# Altium project HighPowerBiPolarStepperProject.PrjPCB
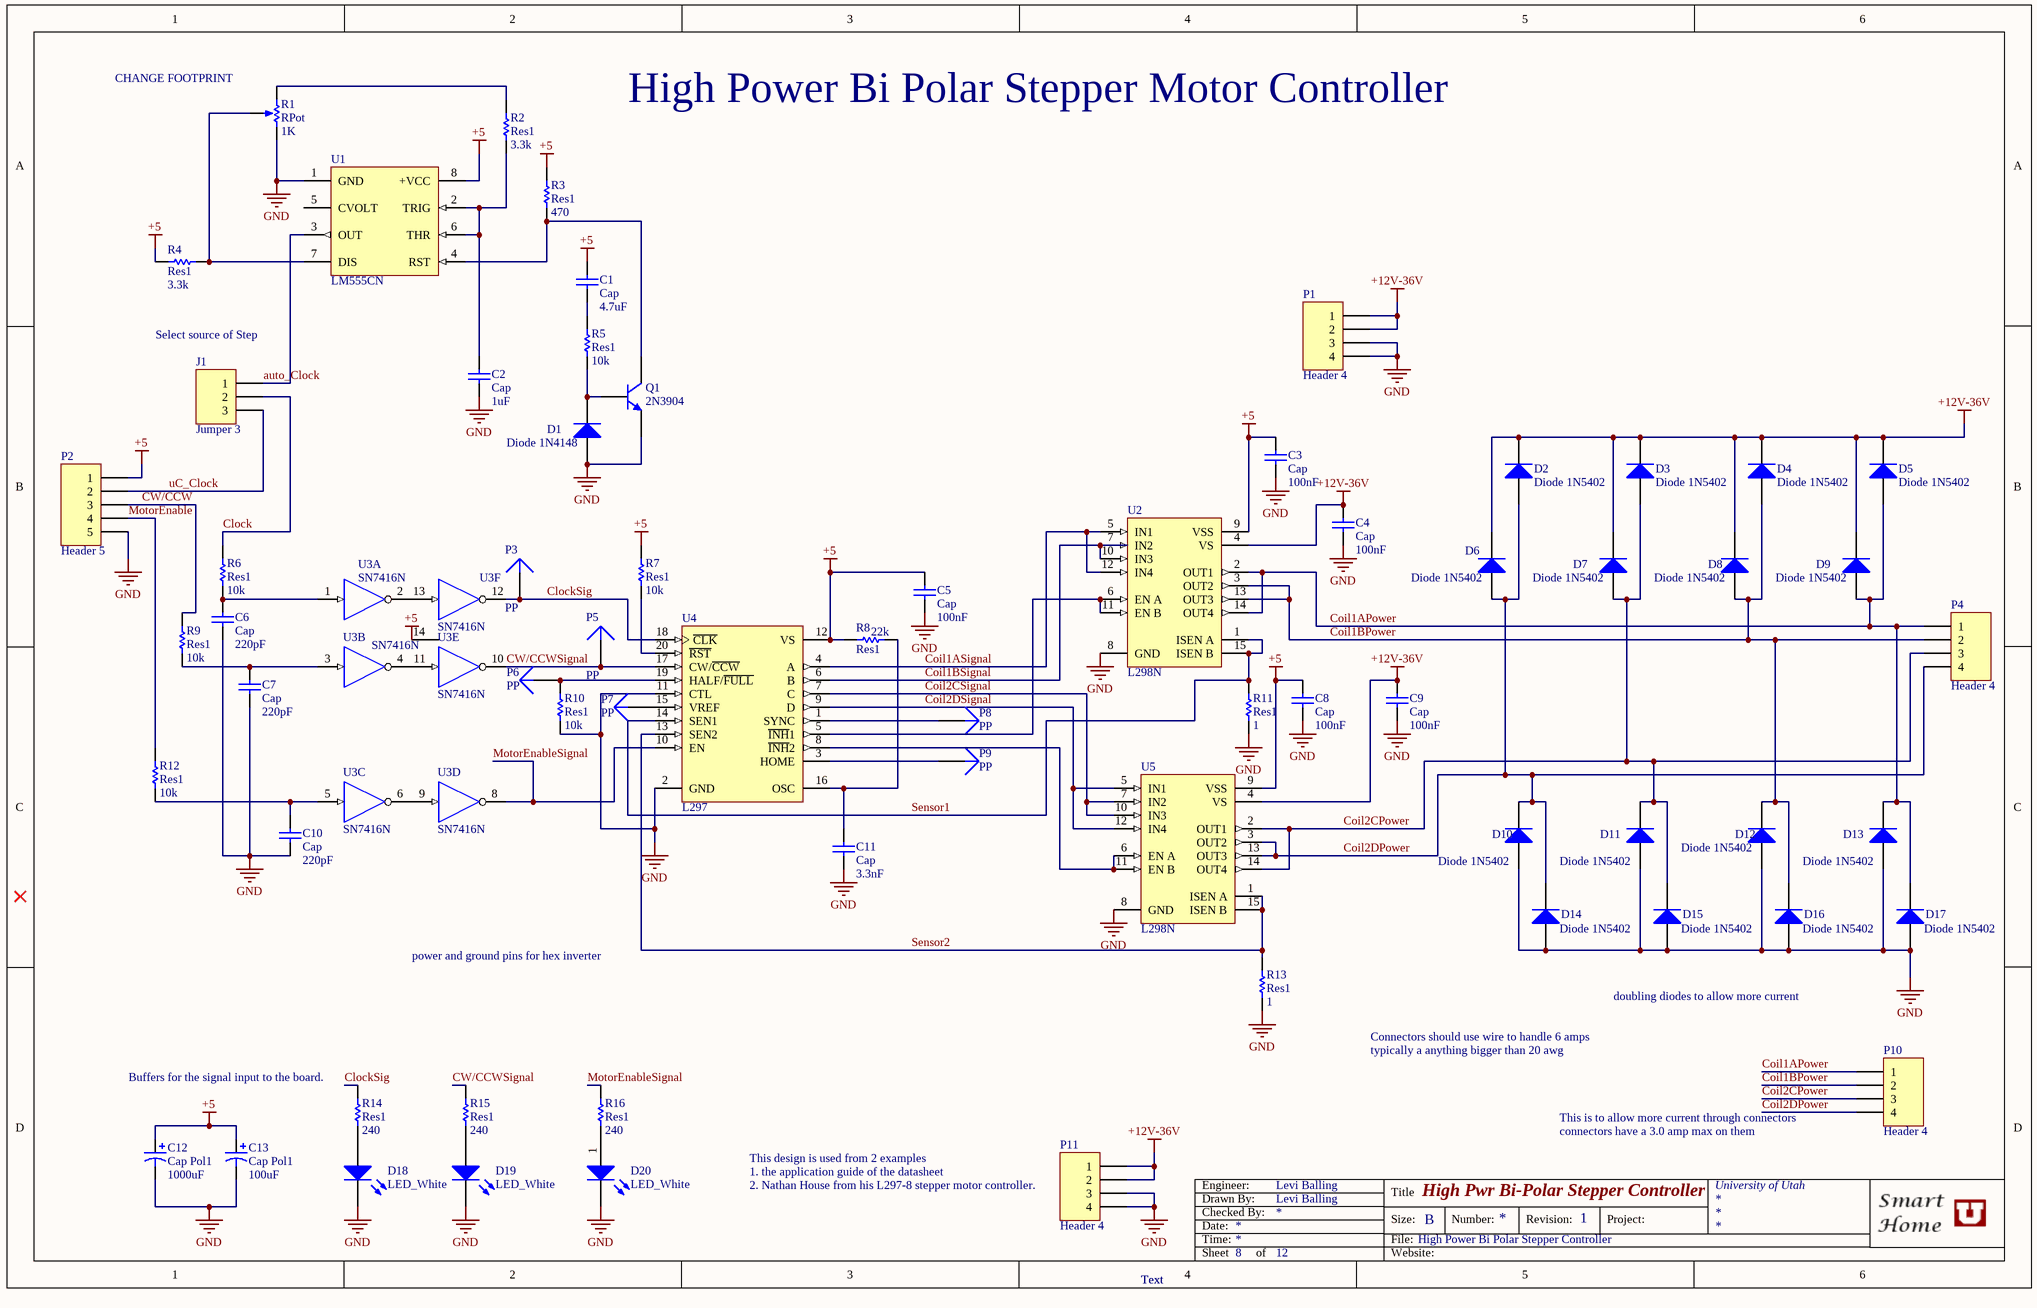
[diagram p0: HighPowerBiPolarStepperMotorSchem.SchDoc]
1 sheet, 67 parts. Net scope: global (net labels, ports and power ports of the same name join across sheets).
Board file: HighPowerBiPolarStepperMotorDriver.PcbDoc

## Sheet HighPowerBiPolarStepperMotorSchem.SchDoc: High Pwr Bi-Polar Stepper Controller
size B; Author: Levi Balling; DrawnBy: Levi Balling; Engineer: Levi Balling; Organization: University of Utah; Revision: 1; SheetNumber: 8; SheetTotal: 12; DocumentName: High Power Bi Polar Stepper Controller; ProjectName: Smart Home

### Parts
C1  Cap  value 4.7uF  [RAD-0.2]
C2  Cap  value 1uF  [RAD-0.2]
C3  Cap  value 100nF  [RAD-0.2]
C4  Cap  value 100nF  [RAD-0.2]
C5  Cap  value 100nF  [RAD-0.2]
C6  Cap  value 220pF  [RAD-0.2]
C7  Cap  value 220pF  [RAD-0.2]
C8  Cap  value 100nF  [RAD-0.2]
C9  Cap  value 100nF  [RAD-0.2]
C10  Cap  value 220pF  [RAD-0.2]
C11  Cap  value 3.3nF  [RAD-0.2]
C12  Cap Pol1  value 1000uF  [RB7.6-15]
C13  Cap Pol1  value 100uF  [RB7.6-15]
D1  Diode 1N4148  [DO-35]
D2  Diode 1N5402  [DO-201AD]
D3  Diode 1N5402  [DO-201AD]
D4  Diode 1N5402  [DO-201AD]
D5  Diode 1N5402  [DO-201AD]
D6  Diode 1N5402  [DO-201AD]
D7  Diode 1N5402  [DO-201AD]
D8  Diode 1N5402  [DO-201AD]
D9  Diode 1N5402  [DO-201AD]
D10  Diode 1N5402  [DO-201AD]
D11  Diode 1N5402  [DO-201AD]
D12  Diode 1N5402  [DO-201AD]
D13  Diode 1N5402  [DO-201AD]
D14  Diode 1N5402  [DO-201AD]
D15  Diode 1N5402  [DO-201AD]
D16  Diode 1N5402  [DO-201AD]
D17  Diode 1N5402  [DO-201AD]
D18  LED_White  [LED]
D19  LED_White  [LED]
D20  LED_White  [LED]
J1  Jumper 3  [HDR1X3]
P1  Header 4  [HDR1X4]
P2  Header 5  [HDR1X5]
P3  PP  [PIN1]
P4  Header 4  [HDR1X4]
P5  PP  [PIN1]
P6  PP  [PIN1]
P7  PP  [PIN1]
P8  PP  [PIN1]
P9  PP  [PIN1]
P10  Header 4  [HDR1X4]
P11  Header 4  [HDR1X4]
Q1  2N3904  [2N3904]
R1  RPot  value 1K  [Variable_Resistor]
R2  Res1  value 3.3k  [AXIAL-0.3]
R3  Res1  value 470  [AXIAL-0.3]
R4  Res1  value 3.3k  [AXIAL-0.3]
R5  Res1  value 10k  [AXIAL-0.3]
R6  Res1  value 10k  [AXIAL-0.3]
R7  Res1  value 10k  [AXIAL-0.3]
R8  Res1  value 22k  [AXIAL-0.3]
R9  Res1  value 10k  [AXIAL-0.3]
R10  Res1  value 10k  [AXIAL-0.3]
R11  Res1  value 1  [AXIAL-1.0]
R12  Res1  value 10k  [AXIAL-0.3]
R13  Res1  value 1  [AXIAL-1.0]
R14  Res1  value 240  [AXIAL-0.3]
R15  Res1  value 240  [AXIAL-0.3]
R16  Res1  value 240  [AXIAL-0.3]
U1  LM555CN  [N08E]
U2  L298N  [Multiwatt15V]
U3  SN7416N  [N014]  (parts A,B,C,D,E,F of 6)
U4  L297  [DIP20]
U5  L298N  [Multiwatt15V]

### Nets
+5: C1.2 C3.2 C5.2 C8.2 C12.1 C13.1 P2.1 R3.1 R4.2 R7.2 R8.1 U1.8(+VCC) U2.9(VSS) U3.14(VCC) U4.12(VS) U5.9(VSS)
+12V-36V: C4.2 C9.2 D2.2(K) D3.2(K) D4.2(K) D5.2(K) D6.2(K) D7.2(K) D8.2(K) D9.2(K) P1.1 P1.2 P11.1 P11.2 U2.4(VS) U5.4(VS)
GND: C2.1 C3.1 C4.1 C5.1 C6.1 C7.1 C8.1 C9.1 C10.1 C11.1 C12.2 C13.2 D1.1(A) D10.1(A) D11.1(A) D12.1(A) D13.1(A) D14.1(A) D15.1(A) D16.1(A) D17.1(A) D18.2(K) D19.2(K) D20.2(K) P1.3 P1.4 P2.5 P11.3 P11.4 Q1.1(E) R1.2(BOT) R10.2 R11.1 R13.1 U1.1(GND) U2.8(GND) U3.7(GND) U4.2(GND) U4.11(CTL) U5.8(GND)
VCC: U3.14(VCC)
auto_Clock: J1.1 U1.3(OUT)
Clock: J1.2 R6.1
ClockSig: P3.1 R14.1 U3.12(Y) U4.18(~{CLK})
Coil1APower: D5.1(A) D9.1(A) D13.2(K) D17.2(K) P4.1 P10.1 U2.2(OUT1) U2.14(OUT4)
Coil1ASignal: U2.5(IN1) U2.12(IN4) U4.4(A)
Coil1BPower: D4.1(A) D8.1(A) D12.2(K) D16.2(K) P4.2 P10.2 U2.3(OUT2) U2.13(OUT3)
Coil1BSignal: U2.7(IN2) U2.10(IN3) U4.6(B)
Coil2CPower: D3.1(A) D7.1(A) D11.2(K) D15.2(K) P4.3 P10.3 U5.2(OUT1) U5.14(OUT4)
Coil2CSignal: U4.7(C) U5.7(IN2) U5.10(IN3)
Coil2DPower: D2.1(A) D6.1(A) D10.2(K) D14.2(K) P4.4 P10.4 U5.3(OUT2) U5.13(OUT3)
Coil2DSignal: U4.9(D) U5.5(IN1) U5.12(IN4)
CW/CCW: P2.3 R9.1
CW/CCWSignal: P5.1 R15.1 U3.10(Y) U4.17(CW/~{CCW})
MotorEnable: P2.4 R12.2
MotorEnableSignal: R16.1 U3.8(Y) U4.10(EN)
Sensor1: R11.2 U2.1(ISEN_A) U2.15(ISEN_B) U4.14(SEN1)
Sensor2: R13.2 U4.13(SEN2) U5.1(ISEN_A) U5.15(ISEN_B)
uC_Clock: J1.3 P2.2
NetC1_1: C1.1 R5.1
NetC2_2: C2.2 R2.1 U1.2(TRIG) U1.6(THR)
NetC6_2: C6.2 R6.2 U3.1(A)
NetC7_2: C7.2 R9.2 U3.3(A)
NetC10_2: C10.2 R12.1 U3.5(A)
NetC11_2: C11.2 R8.2 U4.16(OSC)
NetD1_2: D1.2(K) Q1.2(B) R5.2
NetD18_1: D18.1(A) R14.2
NetD19_1: D19.1(A) R15.2
NetD20_1: D20.1(A) R16.2
NetP6_1: P6.1 R10.1 U4.19(HALF/~{FULL})
NetP7_1: P7.1 U4.15(VREF)
NetP8_1: P8.1 U4.1(SYNC)
NetP9_1: P9.1 U4.3(HOME)
NetQ1_3: Q1.3(C) R3.2 U1.4(RST)
NetR1_1: R1.1(TOP) R2.2
NetR1_3: R1.3(TAP) R4.1 U1.7(DIS)
NetR7_1: R7.1 U4.20(~{RST})
NetU2_6: U2.6(EN_A) U2.11(EN_B) U4.5(~{INH}1)
NetU3_2: U3.2(Y) U3.13(A)
NetU3_4: U3.4(Y) U3.11(A)
NetU3_6: U3.6(Y) U3.9(A)
NetU4_8: U4.8(~{INH}2) U5.6(EN_A) U5.11(EN_B)

Not connected (* = marked no-connect by the designer): U1 5(CVOLT)

### Notes on the sheet
- (near R1) CHANGE FOOTPRINT
- High Power Bi Polar Stepper Motor Controller
- (near J1) Select source of Step
- power and ground pins for hex inverter
- Connectors should use wire to handle 6 amps
- doubling diodes to allow more current
- (near R14) Buffers for the signal input to the board.
- typically a anything bigger than 20 awg
- This design is used from 2 examples
- 1. the application guide of the datasheet
- (near P10) This is to allow more current through connectors
- connectors have a 3.0 amp max on them
- (near P11) 2. Nathan House from his L297-8 stepper motor controller.
- Text
- Date:
- Time:
- Engineer:
- Drawn By:
- Checked By:
- Title
- Size:
- File:
- B
- Number:
- Revision:
- Project:
- Sheet
- of
- Website:

### Library data of the parts
C1-C11 = Cap: Capacitor; Vendor: Taydaelectronics; Published: 8-Jun-2000; LatestRevisionDate: 17-Jul-2002; LatestRevisionNote: Re-released for DXP Platform.; PackageReference: RAD-0.3; Publisher: Altium Limited; PackageDescription: Radial Cap, Thru-Hole; 2 Leads; 0.3 in Pin Spacing; Price: 0.03
C12 C13 = Cap Pol1: Polarized Capacitor (Radial); Vendor: Taydaelectronics; Published: 8-Jun-2000; LatestRevisionDate: 17-Jul-2002; LatestRevisionNote: Re-released for DXP Platform.; PackageReference: RB7.6-15; Publisher: Altium Limited; PackageDescription: Polarized Capacitor (Radial); 2 Leads; Price: 0.03
D1 = Diode 1N4148: High Conductance Fast Diode; Vendor: Taydaelectronics; Published: 8-Jun-2000; LatestRevisionDate: 17-Jul-2002; LatestRevisionNote: Re-released for DXP Platform.; DatasheetVersion: 1997; PackageReference: DO-35; Publisher: Altium Limited; PackageDescription: Diode, Axial; Body 3.8 x 1.9 mm (LxDia. max), Lead Dia. 0.53 mm (max); Code_JEDEC: DO-204-AH; ComponentLink1URL: http://www.fairchildsemi.com/; ComponentLink2Description: Datasheet; ComponentLink2URL: http://www.fairchildsemi.com/ds/1N%2F1N4148.pdf; Price: 0.01; Value: Diode 1N4148
D2-D17 = Diode 1N5402: 3 Amp General Purpose Rectifier; Value: Diode 1N5822; Vendor: Taydaelectronics; Published: 8-Jun-2000; LatestRevisionDate: 17-Jul-2002; LatestRevisionNote: Re-released for DXP Platform.; DatasheetVersion: 1998; PackageVersion: Aug-1999; PackageReference: DO-201AD; Publisher: Altium Limited; PackageDescription: Diode, Axial; Body 9.5 x 5.6 mm (LxDia. max), Lead Dia. 1.32 mm (max); ComponentLink1Description: Manufacturer Link; ComponentLink1URL: http://www.fairchildsemi.com/; ComponentLink2Description: Datasheet; ComponentLink2URL: http://www.fairchildsemi.com/ds/1N%2F1N5400.pdf; Price: 0.19
D18-D20 = LED0: Typical INFRARED GaAs LED; Vendor: Taydaelectronics; Value: White_LED; Published: 8-Jun-2000; LatestRevisionDate: 08-Jul-2005; LatestRevisionNote: Mech Layer 1 removed.; PackageReference: LED-0; Publisher: Altium Limited; PackageDescription: LED; 2 Leads; Price: 0.04
J1 = Header 3: Header, 3-Pin; Vendor: Taydaelectronics; LatestRevisionDate: 17-Jul-2002; LatestRevisionNote: Re-released for DXP Platform.; Publisher: Altium Limited; Price: 0.03; Value: Jumper 3
P1 P4 P10 P11 = Header 4: Header, 4-Pin; Vendor: Taydaelectronics; LatestRevisionDate: 17-Jul-2002; LatestRevisionNote: Re-released for DXP Platform.; Publisher: Altium Limited; Price: 0.04; Value: Header 4
P2 = Header 5: Header, 5-Pin; Vendor: Taydaelectronics; LatestRevisionDate: 17-Jul-2002; LatestRevisionNote: Re-released for DXP Platform.; Publisher: Altium Limited; Price: 0.05; Value: Header 5
P3 P5-P9 = Plug: Vendor: Taydaelectronics; LatestRevisionDate: 17-Jul-2002; LatestRevisionNote: Re-released for DXP Platform.; Publisher: Altium Limited; Price: 0.01; Value: PP
Q1 = 2N3904: NPN General Purpose Amplifier; Vendor: Taydaelectronics; Published: 8-Jun-2000; LatestRevisionDate: 15-Jan-2003; LatestRevisionNote: PCB Footprint 'BCY-W3/D4.7' replaced; DatasheetVersion: 1997; PackageVersion: Sep-1998; PackageReference: TO-92A; Publisher: Altium Limited; PackageDescription: TO, Flat Index; 3 In-Line, Axial Leads; Body Dia. 4.5mm; Leads 0.51 x 0.48 mm (max); ComponentLink1URL: http://www.fairchildsemi.com/; ComponentLink2Description: Datasheet; ComponentLink2URL: http://www.fairchildsemi.com/ds/2N%2F2N3904.pdf; Price: 0.01; Value: 2N3904
R1 = RPot: Potentiometer; Sim Note: Enter the Resistance value and the set point into parameter fields.; Set Position: 0.5; Vendor: Taydaelectronics; Published: 8-Jun-2000; LatestRevisionDate: 17-Jul-2002; LatestRevisionNote: Re-released for DXP Platform.; PackageReference: VR5; Publisher: Altium Limited; PackageDescription: Variable Resistor, Thru-Hole; 3 Leads; Price: 0.07
R2-R16 = Res1: Resistor; Vendor: Taydaelectronics; Published: 8-Jun-2000; LatestRevisionDate: 17-Jul-2002; LatestRevisionNote: Re-released for DXP Platform.; PackageReference: AXIAL-0.3; Publisher: Altium Limited; PackageDescription: Axial Device, Thru-Hole; 2 Leads; 0.3 in Pin Spacing; Price: 0.01
U1 = LM555CN: Timer; Manufacturer: National Semiconductor; CompType: Analog IC; PackageTopMarking: NSUZXYTT*LM*555CN; PowerWise: N; Vendor: Taydaelectronics; Published: 4-Dec-2008; DatasheetVersion: Jul-2006; PackageVersion: revG, May-2006; PackageReference: N08E; Publisher: Altium Limited; PackageDescription: MDIP, .365 x .250 x .130in, 8 Lead, .100in Pitch; PartNumber: LM555CN; PinCount: 8; DigiKeyPartNumber: LM555CNNS-ND; Code_JEDEC: MS-001-BA; ComponentLink1URL: http://www.national.com/ds.cgi/LM/LM555.pdf; ComponentLink2Description: LM555 Web Page; ComponentLink2URL: http://www.national.com/pf/LM/LM555.html; ComponentLink3Description: N08E package page; ComponentLink3URL: http://www.national.com/packaging/folders/n08e.html; Price: 0.14; Value: LM555CN
U2 U5 = L298N: Dual Full Bridge Driver; Vendor: Taydaelectronics; Published: 8-Jun-2000; LatestRevisionDate: 14-May-2007; LatestRevisionNote: Mapped to vertical PCB.; DatasheetVersion: Jul-1999; PackageReference: Multiwatt15V; Publisher: Altium Limited; PackageDescription: TO, Thru-Hole, Vertical, Heatsink Mounted; 15 Bent Staggered Leads; Pitch 1.27 mm; ComponentLink1Description: Manufacturer Link; ComponentLink1URL: http://www.st.com/; ComponentLink2Description: Datasheet; ComponentLink2URL: http://www.st.com/stonline/products/literature/ds/1773/l298.pdf; Price: 1.78; Value: L298N
U3 = SN7416N: Hex Inverter Buffer / Driver with High-Voltage Outputs; Vendor: Taydaelectronics; Published: 8-Jun-2000; LatestRevisionDate: 04-Mar-2005; LatestRevisionNote: Stylized 3D Model Added.; DatasheetVersion: Mar-1988; PackageVersion: Oct-1995; PackageReference: N014; Publisher: Altium Limited; PackageDescription: DIP; 14 Leads; Row Spacing 7.62 mm; Pitch 2.54 mm; ComponentLink1URL: http://www.ti.com/; ComponentLink2Description: Datasheet; ComponentLink2URL: http://www-s.ti.com/sc/ds/sn5416.pdf; ComponentLink3Description: Packaging Specification; ComponentLink3URL: http://focus.ti.com/lit/ml/mpdi002c/mpdi002c.pdf; ComponentLink1Description: Manufacturer Link; Price: 0.20; Value: SN7416N
U4 = L297: Stepper Motor Controller; Vendor: Taydaelectronics; Published: 8-Jun-2000; LatestRevisionDate: 06-Jun-2005; LatestRevisionNote: Stylized 3D Model Added.; DatasheetVersion: Aug-1996; PackageVersion: Jun-1998; PackageReference: DIP20; Publisher: Altium Limited; PackageDescription: DIP; 20 Leads; Row Spacing 7.62 mm; Pitch 2.54 mm; Code_JEDEC: MS-015-AE; ComponentLink1Description: Manufacturer Link; ComponentLink1URL: http://www.st.com/; ComponentLink2Description: Datasheet; ComponentLink2URL: http://www.st.com/stonline/products/literature/ds/1334/l297.pdf; Price: 2.20; Value: L297